# EAGLE design Laminator (EAGLE 7.5.0)
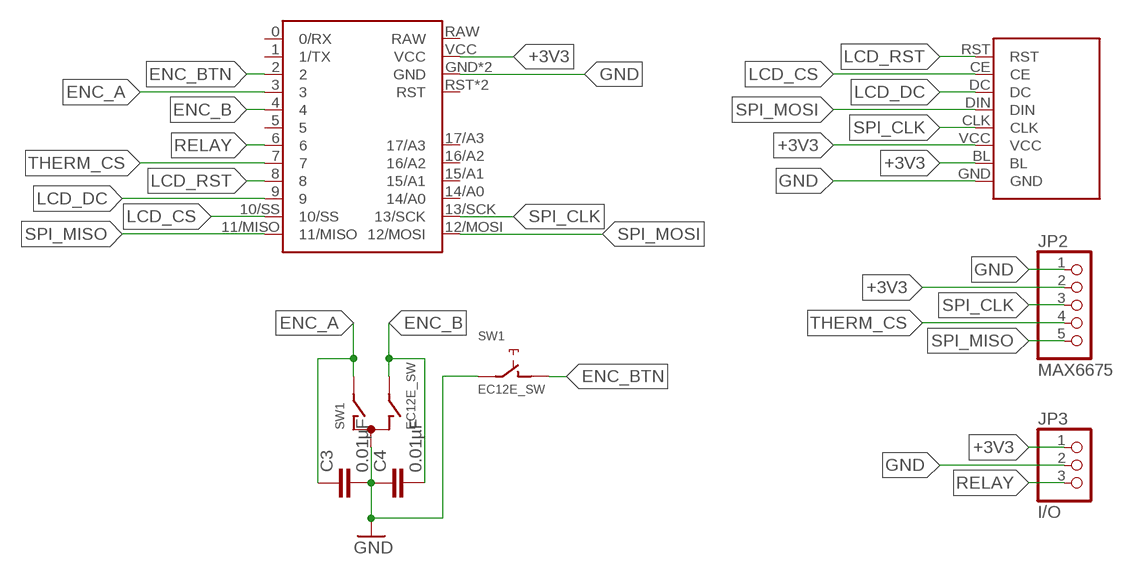
[diagram p0: schematic, sheet 1]

## Parts
ARDUINO  ARDUINO_PRO_MINI_DIL  [ARDUINO_PRO_MINI_B]
C3  0.01µF  C-EU025-025X050  [C025-025X050]
C4  0.01µF  C-EU025-025X050  [C025-025X050]
JP2  MAX6675  PINHD-1X5  [1X05]
JP3  I/O  PINHD-1X3  [1X03]
SW1  EC12E_SW  [ALPS_EC12E_SW]
U$1  NOKIA_5110  [NOKIA_5110]

## Nets
+3V3: ARDUINO.VCC JP2.2 JP3.1 U$1.BL U$1.VCC
ENC_A: ARDUINO.3 C3.1 SW1.A
ENC_B: ARDUINO.4 C4.2 SW1.B
ENC_BTN: ARDUINO.2 SW1.D
GND: ARDUINO.GND ARDUINO.GND@2(GND) C3.2 C4.1 JP2.1 JP3.2 SW1.C SW1.E U$1.GND
LCD_CS: ARDUINO.10/SS U$1.CE
LCD_DC: ARDUINO.9 U$1.DC
LCD_RST: ARDUINO.8 U$1.RST
RELAY: ARDUINO.6 JP3.3
SPI_CLK: ARDUINO.13/SCK JP2.3 U$1.CLK
SPI_MISO: ARDUINO.11/MISO JP2.5
SPI_MOSI: ARDUINO.12/MOSI U$1.DIN
THERM_CS: ARDUINO.7 JP2.4
Unconnected: ARDUINO.0(0/RX) ARDUINO.1(1/TX) ARDUINO.5 ARDUINO.14/A0 ARDUINO.15/A1 ARDUINO.16/A2 ARDUINO.17/A3 ARDUINO.RAW ARDUINO.RST ARDUINO.RST@2(RST) SW1.GND1(G) SW1.GND2(G)

## Library data of the parts
ARDUINO = MyLibrary:ARDUINO_PRO_MINI_DIL
C3 C4 = resistor:C-EU: CAPACITOR, European symbol
JP2 = pinhead:PINHD-1X5: PIN HEADER
JP3 = pinhead:PINHD-1X3: PIN HEADER
SW1 = switch-alps:EC12E_SW: ALPS rotary Encoder EC12E series with switch; MPN: EC12E2424407; OC_FARNELL: 1520813; OC_NEWARK: 74M1068
U$1 = MyLibrary:NOKIA_5110

## Board
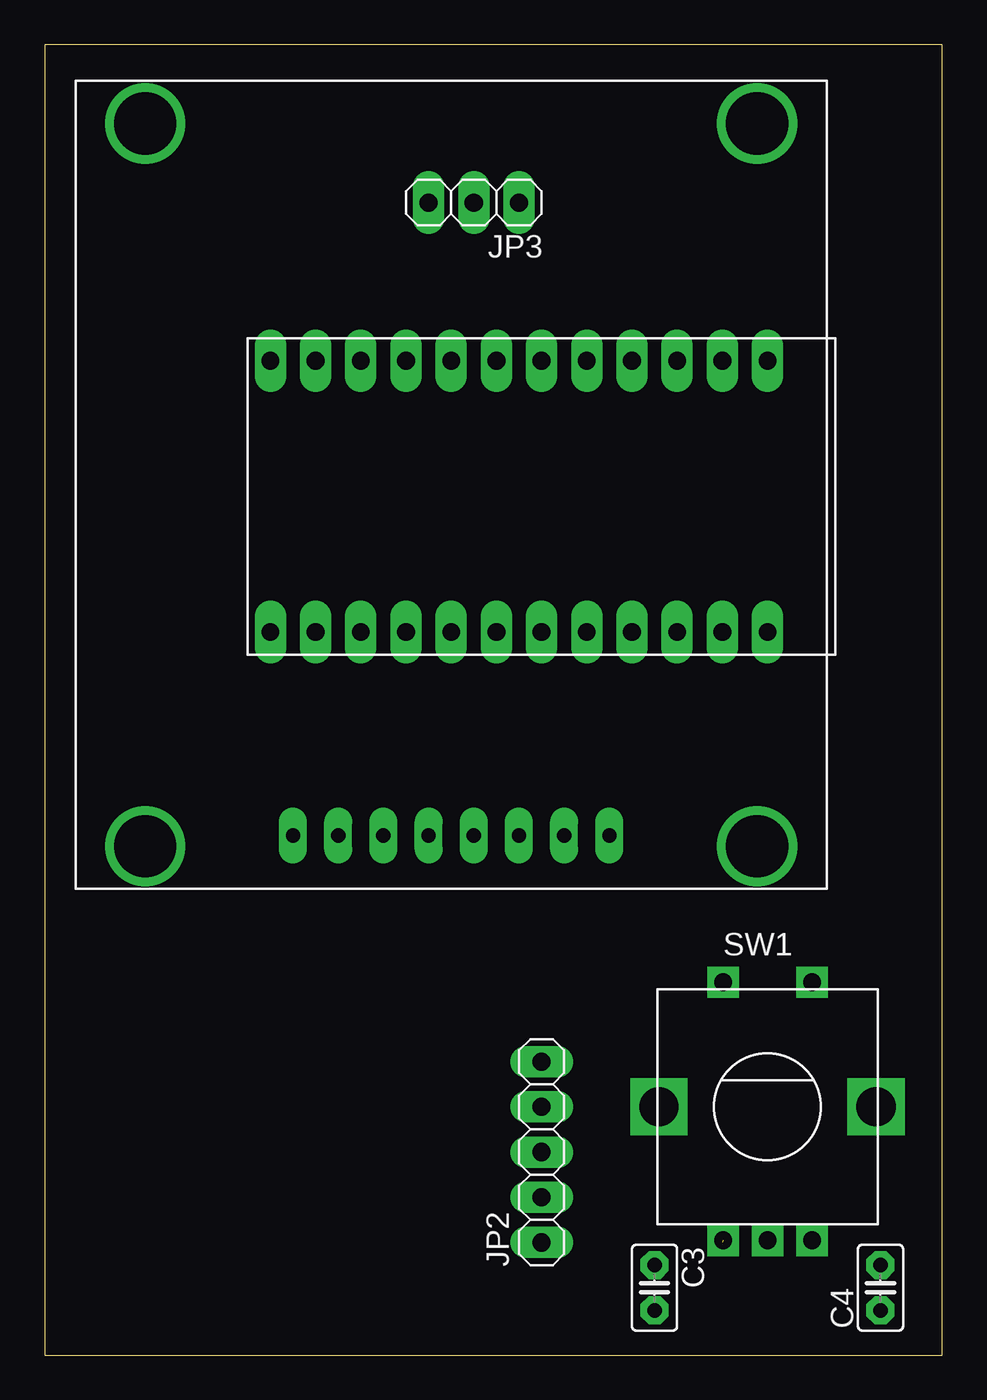
[diagram p1: board, top side]
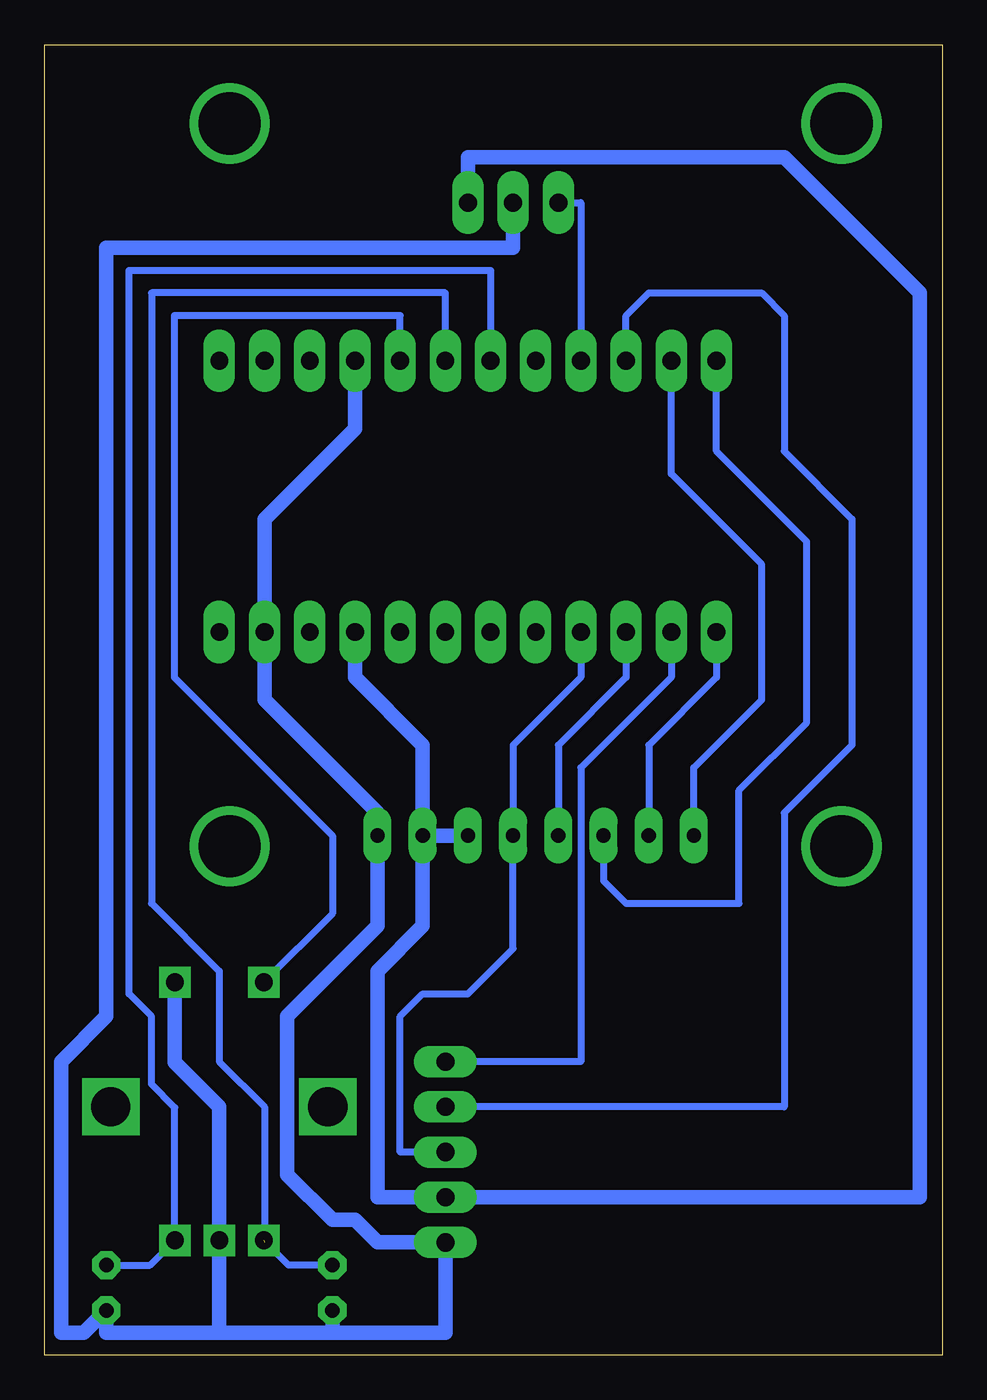
[diagram p2: board, bottom side, seen from below]

Size 50.47 x 73.65 mm. Coordinates in mm from the lower left corner, seen from the top.
Outline: 0,0 50.47,0 50.47,73.65 0,73.65 0,0
Copper layers (1*16): Top 0.035mm / dielectric 1.5mm / Bottom 0.035mm
Design rules "default": minimum track width 16mil, minimum drill 0.8mm, track to track 8mil, track to pad 8mil, pad to pad 8mil, via to via 8mil, smd to smd 8mil, copper to edge 0mil, drill to drill 8mil, minimum pad ring 15mil, minimum via ring 15mil, stop-mask expansion 4mil, vias tented up to drill 0mil, thermal gap 10mil

### Footprints (pad centres in the part's own frame; a part is rotated, then mirrored left to right if it is on the bottom)
ARDUINO_PRO_MINI_B = drill 1 long: 0 1.27,26.67; 1 1.27,29.21; 2 1.27,19.05; 3 1.27,16.51; 4 1.27,13.97; 5 1.27,11.43; 6 1.27,8.89; 7 1.27,6.35; 8 1.27,3.81; 9 1.27,1.27; 10/SS 16.51,1.27; 11/MISO 16.51,3.81; 12/MOSI 16.51,6.35; 13/SCK 16.51,8.89; 14/A0 16.51,11.43; 15/A1 16.51,13.97; 16/A2 16.51,16.51; 17/A3 16.51,19.05; GND 1.27,21.59; GND@2 16.51,26.67; RAW 16.51,29.21; RST 1.27,24.13; RST@2 16.51,24.13; VCC 16.51,21.59
C025-025X050 = drill 0.813 octagon: 1 -1.27,0; 2 1.27,0
1X05 = drill 1.016 long: 1 -5.08,0; 2 -2.54,0; 3 0,0; 4 2.54,0; 5 5.08,0
1X03 = drill 1.016 long: 1 -2.54,0; 2 0,0; 3 2.54,0
ALPS_EC12E_SW = drill 1 square: A -2.5,-7.5; B 2.5,-7.5; C 0,-7.5; D -2.5,7; E 2.5,7 | drill 2.2 square: GND1 -6.1,0; GND2 6.1,0
NOKIA_5110 = drill 0.8 long: BL 25.4,2.54; CE 12.7,2.54; CLK 20.32,2.54; DC 15.24,2.54; DIN 17.78,2.54; GND 27.94,2.54; RST 10.16,2.54; VCC 22.86,2.54 | drill 3.5: P$1 1.85,42.54; P$2 36.25,42.54; P$3 36.25,1.94; P$4 1.85,1.94

### Placement (x,y rotation side)
ARDUINO  11.43,57.15 270 top
C3  34.29,3.81 270 top
C4  46.99,3.81 90 top
JP2  27.94,11.43 90 top
JP3  24.13,64.77 180 top
SW1  40.64,13.97 0 top
U$1  3.81,26.67 0 top

### Tracks (layer width: path | path; a pad name or v marks a point on that pad's centre or on a via)
+3V3
  Bottom 0.813: U$1.VCC U$1.BL | U$1.BL 29.21,34.29 33.02,38.1 ARDUINO.VCC | JP3.1 26.67,67.31 8.89,67.31 1.27,59.69 1.27,8.89 JP2.2 31.75,8.89 31.75,21.59 29.21,24.13 U$1.BL
ENC_A  (1 unrouted)
  Bottom 0.406: ARDUINO.3 27.94,59.69 44.45,59.69 44.45,25.4 40.64,21.59 40.64,16.51 38.1,13.97 38.1,6.35 | C3.1 36.75,5.08 SW1.A
ENC_B
  Bottom 0.406: C4.2 44.53,5.08 SW1.B 43.14,13.93 44.45,15.24 44.45,19.05 45.72,20.32 45.72,60.96 25.4,60.96 ARDUINO.4
ENC_BTN
  Bottom 0.406: 30.48,54.61 ARDUINO.2 30.48,58.42 43.18,58.42 43.18,38.1 34.29,29.21 34.29,24.82 SW1.D
GND
  Bottom 0.813: 34.29,1.27 27.94,1.27 JP2.1 31.75,6.35 33.02,7.62 34.29,7.62 36.83,10.16 36.83,19.05 31.75,24.13 U$1.GND 31.75,30.48 38.1,36.83 ARDUINO.GND@2 38.1,46.99 33.02,52.07 ARDUINO.GND | 34.29,1.27 40.64,1.27 | 40.64,1.27 SW1.C 40.64,13.97 43.14,16.47 SW1.E | C3.2 34.29,1.27 | 40.64,1.27 46.99,1.27 C4.1 48.26,1.27 49.53,1.27 49.53,16.51 46.99,19.05 46.99,62.23 24.13,62.23 JP3.2
LCD_CS
  Bottom 0.406: ARDUINO.10/SS 12.7,38.1 16.51,34.29 U$1.CE
LCD_DC
  Bottom 0.406: U$1.DC 19.05,26.67 17.78,25.4 11.43,25.4 11.43,31.75 7.62,35.56 7.62,45.72 12.7,50.8 ARDUINO.9
LCD_RST
  Bottom 0.406: U$1.RST 13.97,33.02 10.16,36.83 10.16,44.45 15.24,49.53 ARDUINO.8
RELAY
  Bottom 0.406: JP3.3 20.32,64.77 ARDUINO.6
SPI_CLK
  Bottom 0.406: ARDUINO.13/SCK 20.32,38.1 24.13,34.29 U$1.CLK 24.13,22.86 26.67,20.32 29.21,20.32 30.48,19.05 30.48,11.43 JP2.3
SPI_MISO
  Bottom 0.406: ARDUINO.11/MISO 15.24,38.1 20.32,33.02 20.32,16.51 JP2.5
SPI_MOSI
  Bottom 0.406: ARDUINO.12/MOSI 17.78,38.1 21.59,34.29 U$1.DIN
THERM_CS
  Bottom 0.406: ARDUINO.7 17.78,58.42 16.51,59.69 10.16,59.69 8.89,58.42 8.89,50.8 5.08,46.99 5.08,34.29 8.89,30.48 8.89,13.97 JP2.4